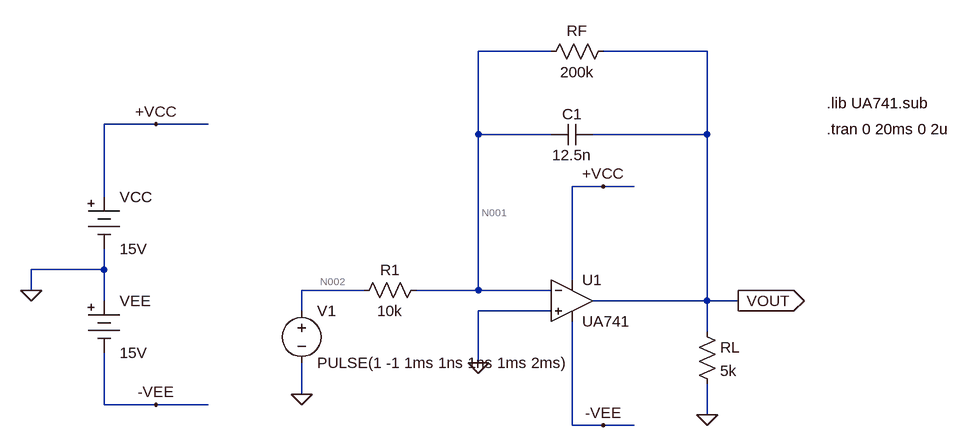
[diagram p0: schematic lab4-3.asc]
lab4-3.asc, the LTspice schematic file:
Version 4
SHEET 1 960 724
WIRE 304 -208 192 -208
WIRE 544 -208 384 -208
WIRE -304 -96 -384 -96
WIRE -224 -96 -304 -96
WIRE 192 -80 192 -208
WIRE 304 -80 192 -80
WIRE 544 -80 544 -208
WIRE 544 -80 368 -80
WIRE 384 0 336 0
WIRE 432 0 384 0
WIRE -384 16 -384 -96
WIRE -384 128 -384 96
WIRE -384 128 -496 128
WIRE 336 144 336 0
WIRE -496 160 -496 128
WIRE 16 160 -80 160
WIRE 192 160 192 -80
WIRE 192 160 96 160
WIRE 304 160 192 160
WIRE -384 176 -384 128
WIRE 544 176 544 -80
WIRE 544 176 368 176
WIRE 592 176 544 176
WIRE -80 192 -80 160
WIRE 304 192 192 192
WIRE 544 224 544 176
WIRE 192 272 192 192
WIRE -80 320 -80 272
WIRE -384 336 -384 256
WIRE -304 336 -384 336
WIRE -224 336 -304 336
WIRE 544 352 544 304
WIRE 336 368 336 208
WIRE 384 368 336 368
WIRE 432 368 384 368
FLAG 592 176 VOUT
IOPIN 592 176 Out
FLAG -496 160 0
FLAG -304 -96 +VCC
FLAG 384 0 +VCC
FLAG -304 336 -VEE
FLAG 384 368 -VEE
FLAG 544 352 0
FLAG 192 272 0
FLAG -80 320 0
SYMBOL Opamps\\opamp2 336 112 R0
SYMATTR InstName U1
SYMATTR Value UA741
SYMBOL res 528 208 R0
SYMATTR InstName RL
SYMATTR Value 5k
SYMBOL Misc\\battery -384 0 R0
SYMATTR InstName VCC
SYMATTR Value 15V
SYMBOL Misc\\battery -384 160 R0
SYMATTR InstName VEE
SYMATTR Value 15V
SYMBOL cap 368 -96 R90
WINDOW 0 0 32 VBottom 2
WINDOW 3 32 32 VTop 2
SYMATTR InstName C1
SYMATTR Value 12.5n
SYMBOL res 112 144 R90
WINDOW 0 0 56 VBottom 2
WINDOW 3 32 56 VTop 2
SYMATTR InstName R1
SYMATTR Value 10k
SYMBOL voltage -80 176 R0
WINDOW 123 0 0 Left 2
WINDOW 39 0 0 Left 2
SYMATTR InstName V1
SYMATTR Value PULSE(1 -1 1ms 1ns 1ns 1ms 2ms)
SYMBOL res 400 -224 R90
WINDOW 0 0 56 VBottom 2
WINDOW 3 32 56 VTop 2
SYMATTR InstName RF
SYMATTR Value 200k
TEXT 728 -128 Left 2 !.lib UA741.sub
TEXT 728 -88 Left 2 !.tran 0 20ms 0 2u

The netlist it stands for:
* lab4-3.asc
XU1 0 N001 +VCC -VEE VOUT UA741  ; pins In+ In- V+ V- OUT
RL VOUT 0 5k
VCC +VCC 0 15V
VEE 0 -VEE 15V
C1 VOUT N001 12.5n
R1 N001 N002 10k
V1 N002 0 PULSE(1 -1 1ms 1ns 1ns 1ms 2ms)
RF VOUT N001 200k
.lib UA741.sub
.tran 0 20ms 0 2u
.backanno
.end

* Results of the author's LTspice run, read from the files saved beside the schematic
* Operating Point, zero values left out:
*   V(vout) = -13.01 V
*   V(-vee) = -15 V
*   V(+vcc) = 15 V
*   V(n001) = 331.6 mV
*   V(n002) = 1 V
*   I(Rf) = -66.68 µA
*   I(R1) = -66.84 µA
*   I(Rl) = -2.601 mA
*   I(V1) = -66.84 µA
*   I(Vee) = -1.655 mA
*   I(Vcc) = -1.667 mA
*   Ix(u1:1) = -13.44 pA
*   Ix(u1:2) = 159.7 nA
*   Ix(u1:3) = 1.667 mA
*   Ix(u1:4) = -1.655 mA
*   Ix(u1:5) = 2.668 mA
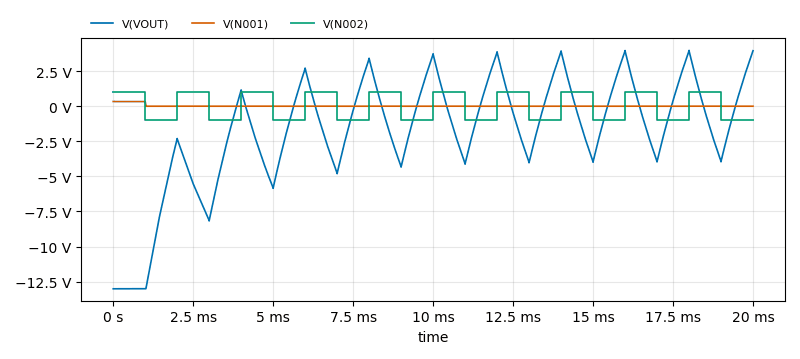
[diagram p1: Transient Analysis of lab4-3.asc, plotted from the saved traces]
* Transient Analysis, 1 run:
*   V(VOUT): min -13.01 V, max 3.976 V, average -1.795 V, rms 4.411 V, last 3.953 V
*   V(N001): min -27.95 mV, max 331.6 mV, average 16.66 mV, rms 74.43 mV, last -970.1 µV
*   V(N002): min -1 V, max 1 V, average -850 nV, rms 1 V, last -1 V